# Altium schematic sheet SCHEM_PRACTICE.SchDoc
size A4; SheetNumber: 1; SheetTotal: 1
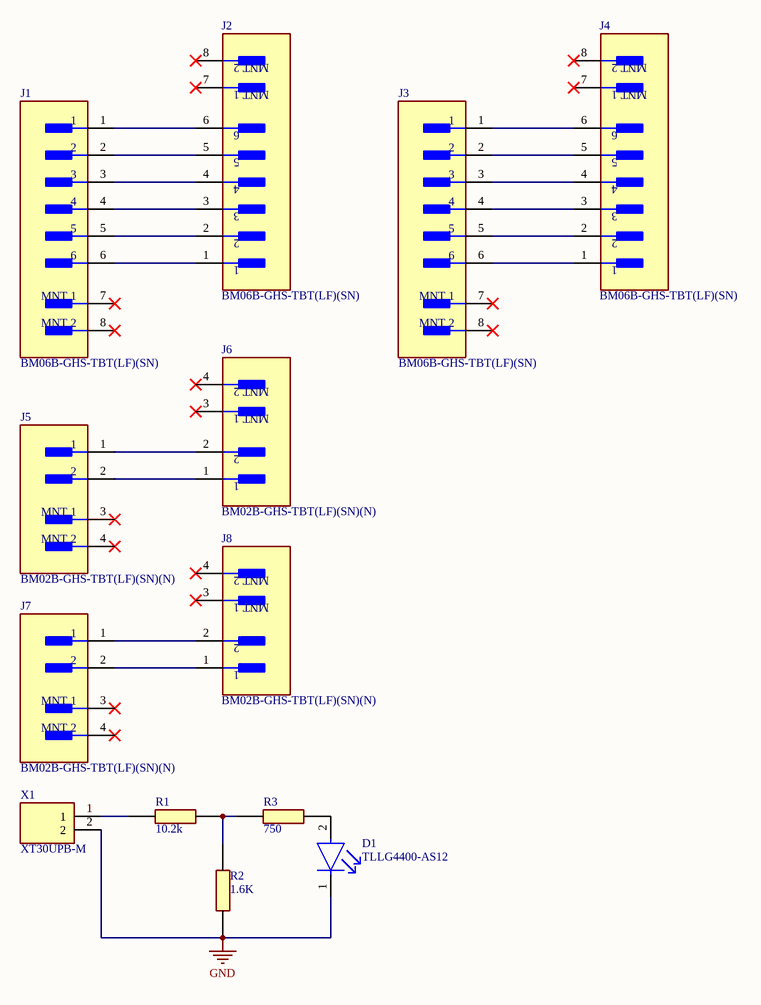
[diagram p0: SCHEM_PRACTICE.SchDoc]

## Parts
D1  TLLG4400-AS12  [FP-6_544-5255_01-4-MFG]
J1  BM06B-GHS-TBT(LF)(SN)  [FP-BM06B-GHS-TBT_LF_SN-MFG]
J2  BM06B-GHS-TBT(LF)(SN)  [FP-BM06B-GHS-TBT_LF_SN-MFG]
J3  BM06B-GHS-TBT(LF)(SN)  [FP-BM06B-GHS-TBT_LF_SN-MFG]
J4  BM06B-GHS-TBT(LF)(SN)  [FP-BM06B-GHS-TBT_LF_SN-MFG]
J5  BM02B-GHS-TBT(LF)(SN)(N)  [FP-BM02B-GHS-TBT_LF_SN-MFG]
J6  BM02B-GHS-TBT(LF)(SN)(N)  [FP-BM02B-GHS-TBT_LF_SN-MFG]
J7  BM02B-GHS-TBT(LF)(SN)(N)  [FP-BM02B-GHS-TBT_LF_SN-MFG]
J8  BM02B-GHS-TBT(LF)(SN)(N)  [FP-BM02B-GHS-TBT_LF_SN-MFG]
R1  10.2k  [RESC2012X50N]
R2  1.6K  [RESC2012X60N]
R3  750  [RESC2012X60N]
X1  XT30UPB-M  [SHDR2W160P0X500_1X2_1020X520X1070P]

## Nets
GND: D1.1(C) R2.1 X1.2
NetD1_2: D1.2(A) R3.2
NetJ1_1: J1.1 J2.6
NetJ1_2: J1.2 J2.5
NetJ1_3: J1.3 J2.4
NetJ1_4: J1.4 J2.3
NetJ1_5: J1.5 J2.2
NetJ1_6: J1.6 J2.1
NetJ3_1: J3.1 J4.6
NetJ3_2: J3.2 J4.5
NetJ3_3: J3.3 J4.4
NetJ3_4: J3.4 J4.3
NetJ3_5: J3.5 J4.2
NetJ3_6: J3.6 J4.1
NetJ5_1: J5.1 J6.2
NetJ5_2: J5.2 J6.1
NetJ7_1: J7.1 J8.2
NetJ7_2: J7.2 J8.1
NetR1_1: R1.1 X1.1
NetR1_2: R1.2 R2.2 R3.1

Not connected (* = marked no-connect by the designer): J1 7(MNT_1)* 8(MNT_2)*; J2 7(MNT_1)* 8(MNT_2)*; J3 7(MNT_1)* 8(MNT_2)*; J4 7(MNT_1)* 8(MNT_2)*; J5 3(MNT_1)* 4(MNT_2)*; J6 3(MNT_1)* 4(MNT_2)*; J7 3(MNT_1)* 4(MNT_2)*; J8 3(MNT_1)* 4(MNT_2)*

## Library data of the parts
D1 = CMP-02520-000017-1: LED GREEN DIFFUSED T-1 T/H; Number of Elements: 1; Forward Voltage: 2.4V; Luminous Intensity: 2mcd; Reverse Voltage: 20V; Power Dissipation: 20mW; Dominant Wavelength: 575nm; Forward Current: 7mA; Viewing Angle: 50°; Test Current: 2mA; Number of Pins: 2; Lens Style: Diffused; Color: Green; Case/Package: T; Depth: 3.2mm; Length: 3.2mm; Number of LEDs: 1; Mount: Through Hole; Radiation Hardening: No; Max Operating Temperature: 100°C; RoHS Compliant: No; Min Operating Temperature: -40°C; Packaging: Tape and Reel
J1-J4 = CMP-17439-000166-1: CONN HEADER SMD 6POS 1.25MM; Number of Contacts: 6; Current Rating: 1A; Voltage Rating: 50V; Housing Material: Nylon; Lead Free: Lead Free; Pitch: 1.25mm; Packaging: Cut Tape; Number of Rows: 1; Series: GH; Contact Material: Bronze; Orientation: Straight; Termination: Solder; Mount: Surface Mount; Housing Color: Natural; Number of Positions: 6
J5-J8 = CMP-2000-05957-2: CONN HEADER SMD 2POS 1.25MM; Pitch: 0.049inch; Connector Type: Outer Shroud Contact; Number of Positions: 2; Packaging: Tape and Reel; Lead Free: Lead Free; Termination: Solder; Fastening Type: Ramp; Number of Rows: 1; Color: Natural; Contact Plating: Tin; Mount: Surface Mount
R1 = CRCW080510K2FKEA: Resistor; Manufacturer_Name: Vishay; Datasheet Link: http://www.vishay.com/docs/20035/dcrcwe3.pdf; Height: 0.5mm; Manufacturer_Part_Number: CRCW080510K2FKEA; Mouser Part Number: 71-CRCW0805-10.2K-E3; Mouser Price/Stock: https://www.mouser.co.uk/ProductDetail/Vishay-Dale/CRCW080510K2FKEA?qs=LOX6nxTstibTXRK16X5NEQ%3D%3D; Arrow Part Number: CRCW080510K2FKEA; Arrow Price/Stock: https://www.arrow.com/en/products/crcw080510k2fkea/vishay?region=nac
R2 = CRCW08051K60FKEAC: Resistor; Manufacturer_Name: Vishay; Datasheet Link: https://www.arrow.com/en/products/crcw08051k60fkeac/vishay; Height: 0.6mm; Manufacturer_Part_Number: CRCW08051K60FKEAC; Mouser Part Number: 71-CRCW08051K60FKEAC; Mouser Price/Stock: https://www.mouser.co.uk/ProductDetail/Vishay-Dale/CRCW08051K60FKEAC?qs=E3Y5ESvWgWMJaZYHQus8LQ%3D%3D; Arrow Part Number: CRCW08051K60FKEAC; Arrow Price/Stock: https://www.arrow.com/en/products/crcw08051k60fkeac/vishay
R3 = CRCW0805750RFKEAHP: Resistor; Manufacturer_Name: Vishay; Datasheet Link: https://componentsearchengine.com/Datasheets/1/CRCW08051R00FKEAHP.pdf; Height: 0.6mm; Manufacturer_Part_Number: CRCW0805750RFKEAHP; Mouser Part Number: 71-CRCW0805750RFKEAH; Mouser Price/Stock: https://www.mouser.co.uk/ProductDetail/Vishay-Dale/CRCW0805750RFKEAHP?qs=40TFAHZMFvdp5ouInDDfaw%3D%3D; Arrow Part Number: CRCW0805750RFKEAHP; Arrow Price/Stock: https://www.arrow.com/en/products/crcw0805750rfkeahp/vishay?region=nac
X1 = XT30UPB-M: Connector; Manufacturer_Name: Amass; Datasheet Link: https://www.tme.eu/Document/4acc913878197f8c2e30d4b8cdc47230/XT30UPB%20SPEC.pdf; Height: 10.7mm; Manufacturer_Part_Number: XT30UPB-M